# EAGLE design PlantWateringSolution (EAGLE 7.5.0)
Assembly variants: <unnamed>
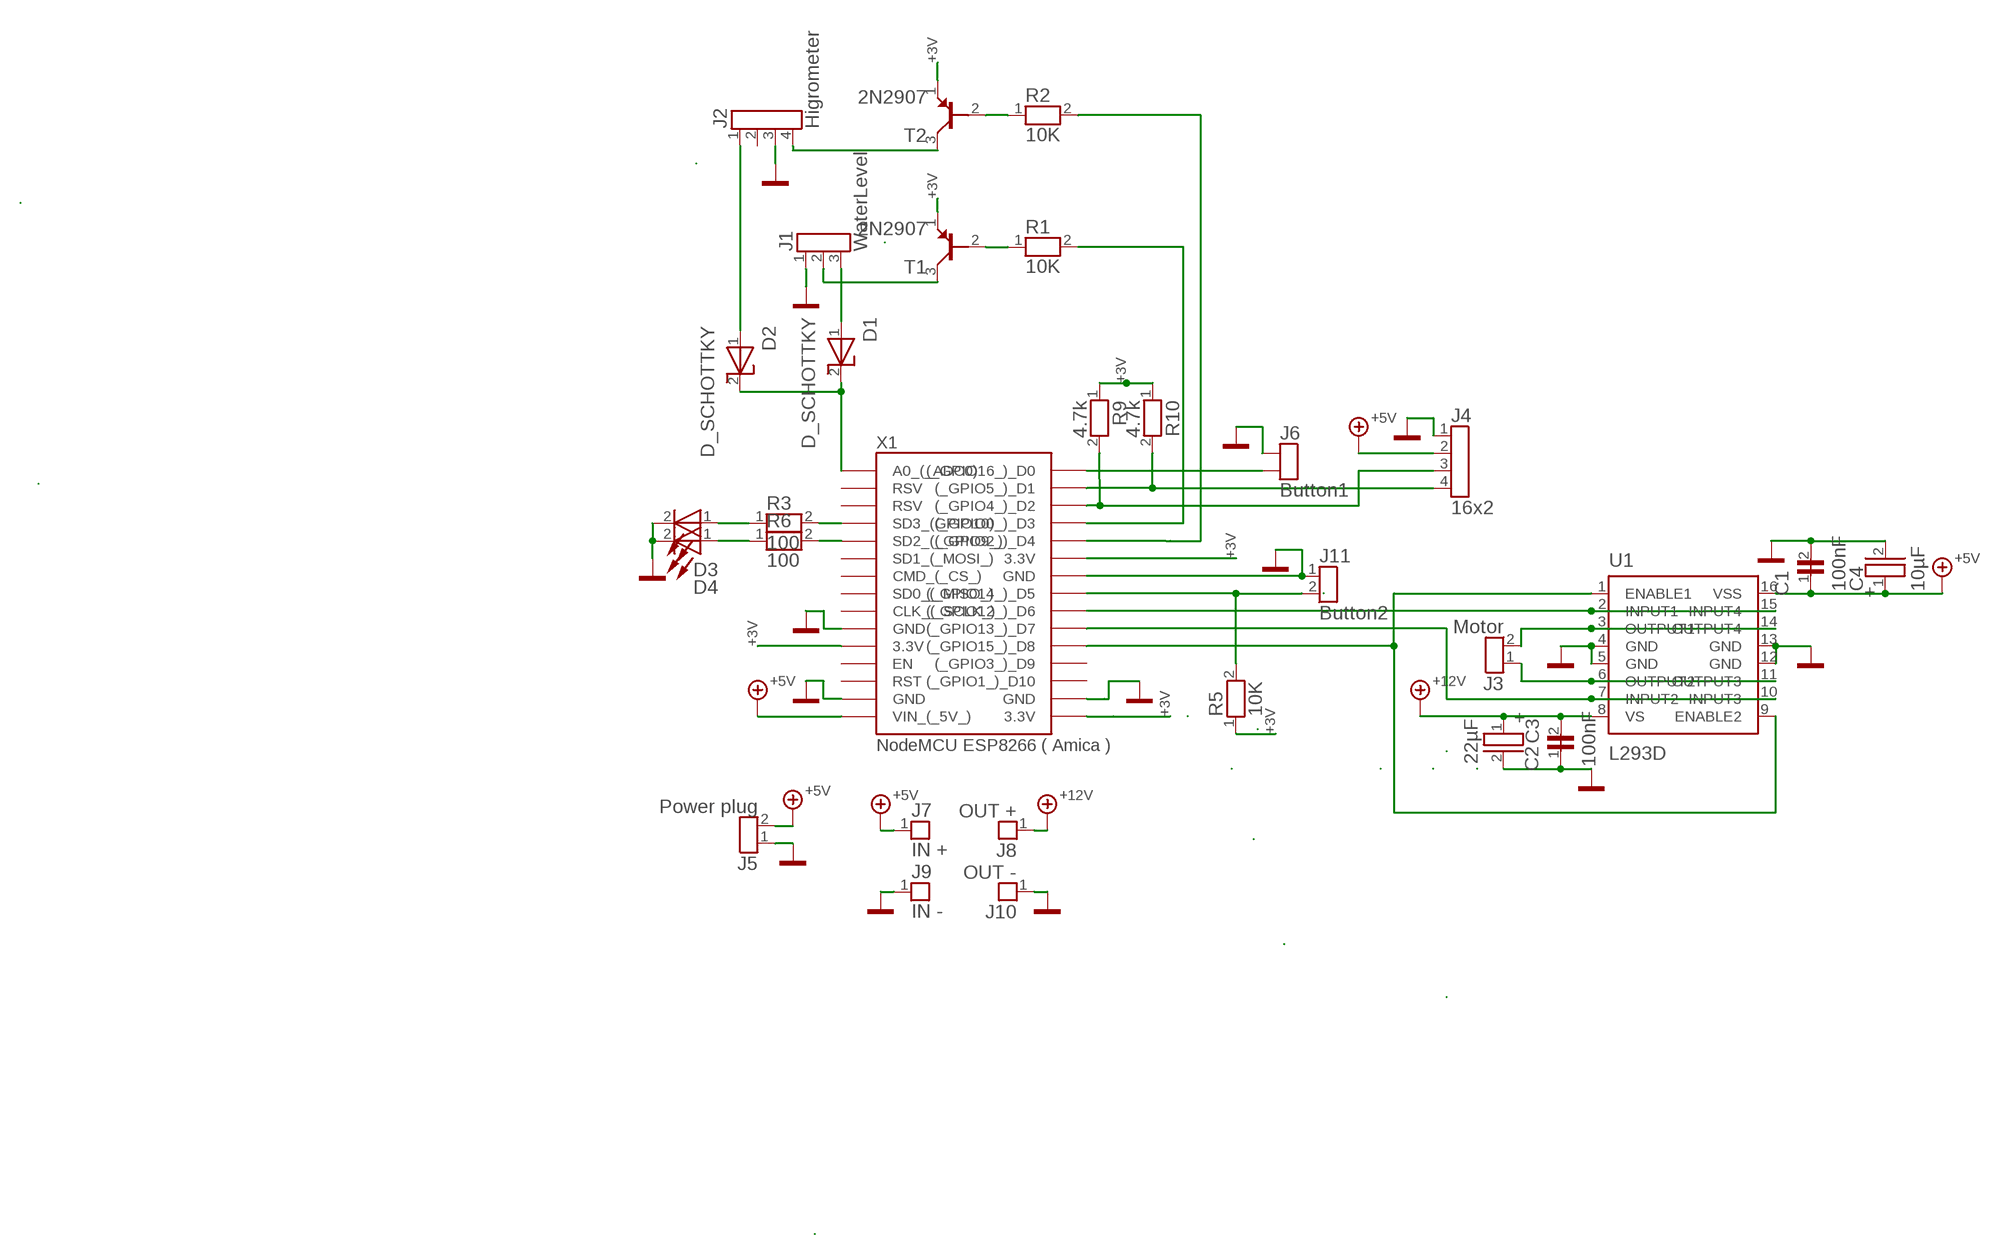
[diagram p0: schematic, sheet 1]

## Parts
C1  100nF  C-CERAMIC-2,54_100V_2%_100PF_18  [6X6R2,54_DISC_18]
C2  100nF  C-CERAMIC-2,54_100V_2%_100PF_19  [6X6R2,54_DISC_19]
C3  22µF  489D_10V_22µF_20  [D6R2,54_ELKO_20]
C4  10µF  489D_10V_22µF_21  [D6R2,54_ELKO_21]
D1  D_SCHOTTKY  D_SCHOTTKY_5  [DO35_5]
D2  D_SCHOTTKY  D_SCHOTTKY_6  [DO35_6]
D3  HLMA-KH00  HLMA-KH00_47  [LED_3MM_RED_47]
D4  HLMA-KH00  HLMA-KH00_42  [LED_3MM_RED_42]
D5  HLMA-KH00  HLMA-KH00_49  [LED_3MM_RED_49]  (not placed on a sheet)
J1  WaterLevel  PINHEADER_1X03_G_2,54_2  [STIFTLEISTE_1X03_G_2,54_2]
J2  Higrometer  PINHEADER_1X04_G_2,54_3  [STIFTLEISTE_1X04_G_2,54_3]
J3  Motor  PINHEADER_1X02_G_2,54_4  [STIFTLEISTE_1X02_G_2,54_4]
J4  16x2  PINHEADER_1X04_G_2,54_43  [STIFTLEISTE_1X04_G_2,54_43]
J5  Power plug  PINHEADER_1X02_G_2,54_50  [STIFTLEISTE_1X02_G_2,54_50]
J6  Button1  PINHEADER_1X02_G_2,54_60  (no package)
J7  IN +  PINHEADER_1X01_G_2,54_32  [STIFTLEISTE_1X01_G_2,54_32]
J8  OUT +  PINHEADER_1X01_G_2,54_33  [STIFTLEISTE_1X01_G_2,54_33]
J9  IN -  PINHEADER_1X01_G_2,54_34  [STIFTLEISTE_1X01_G_2,54_34]
J10  OUT -  PINHEADER_1X01_G_2,54_35  [STIFTLEISTE_1X01_G_2,54_35]
J11  Button2  PINHEADER_1X02_G_2,54_53  [STIFTLEISTE_1X02_G_2,54_53]
R1  10K  R-METAL_FILM_MF_0,4W_1%_510-KOHM_9  [0204_MET_9]
R2  10K  R-METAL_FILM_MF_0,4W_1%_510-KOHM_10  [0204_MET_10]
R3  100  R-METAL_FILM_MF_0,4W_1%_510-KOHM_46  [0204_MET_46]
R4  100  R-METAL_FILM_MF_0,4W_1%_510-KOHM_48  [0204_MET_48]  (not placed on a sheet)
R5  10K  R-METAL_FILM_MF_0,4W_1%_510-KOHM_31  [0204_MET_31]
R6  100  R-METAL_FILM_MF_0,4W_1%_510-KOHM_41  [0204_MET_41]
R9  4.7k  R-METAL_FILM_MF_0,4W_1%_510-KOHM_55  [0204_MET_55]
R10  4.7k  R-METAL_FILM_MF_0,4W_1%_510-KOHM_56  [0204_MET_56]
T1  2N2907  2N2907_7  [TO18_7]
T2  2N2907  2N2907_8  [TO18_8]
U1  L293D  L293D_1  [DIL16_1]
X1  NodeMCU ESP8266 ( Amica )  NODEMCU_ESP8266_(_AMICA_)_0  [NODEMCU_ESP8266_DEV_0]

## Nets
1: R2.1 T2.2(B)
(_GPIO16_)_D0: J6.2 X1.30((_GPIO16_)_D0)
+3V: R5.1 R9.1 R10.1 T1.1(E) T2.1(E) X1.11(3.3V) X1.16(3.3V) X1.25(3.3V)
+5V: C1.1 C4.1(+) J4.2 J5.2 J7.1 U1.16(VSS) X1.15(VIN_(_5V_))
+12V: C2.2 C3.1(+) J8.1 U1.8(VS)
A: D3.1(A) R3.1
B: R1.1 T1.2(B)
BUTTON3: J11.2 R5.2 X1.23((_GPIO14_)_D5)
ENABLE: U1.1(ENABLE1) U1.9(ENABLE2) X1.20((_GPIO15_)_D8)
GND: C1.2 C2.1 C3.2(-) C4.2(-) D3.2(K) D4.2(K) J1.1 J2.3 J4.1 J5.1 J6.1 J9.1 J10.1 J11.1 U1.4(GND) U1.5(GND) U1.12(GND) U1.13(GND) X1.10(GND) X1.14(GND) X1.17(GND) X1.24(GND)
HIGROMETER_SIG: D2.1(A) J2.1
HIGROMETER_VIN: J2.4 T2.3(C)
INPUT1: U1.2(INPUT1) U1.15(INPUT4) X1.22((_GPIO12_)_D6)
INPUT2: U1.7(INPUT2) U1.10(INPUT3) X1.21((_GPIO13_)_D7)
K: D1.2(K) D2.2(K) X1.1(A0_(_ADC0))
OUTPUT1: J3.2 U1.3(OUTPUT1) U1.14(OUTPUT4)
OUTPUT2: J3.1 U1.6(OUTPUT2) U1.11(OUTPUT3)
SCL: J4.4 R10.2 X1.29((_GPIO5_)_D1)
SD2_(_GPIO9_): R6.2 X1.5(SD2_(_GPIO9_))
SDA: J4.3 R9.2 X1.28((_GPIO4_)_D2)
SIG$127: D4.1(A) R6.1
SIG$131: R3.2 X1.4(SD3_(GPIO10))
SIG$151: J1.2 T1.3(C)
SIG$155: R2.2 X1.26((_GPIO2_)_D4)
WATERLEVEL_PNP: R1.2 X1.27((_GPIO0_)_D3)
WATERLEVEL_SIG: D1.1(A) J1.3
Unconnected: D5.1 D5.2 J2.2 R4.1 R4.2 X1.2(RSV) X1.3(RSV) X1.6(SD1_(_MOSI_)) X1.7(CMD_(_CS_)) X1.8(SD0_(_MISO_)) X1.9(CLK_(_SCLK_)) X1.12(EN) X1.13(RST) X1.18((_GPIO1_)_D10) X1.19((_GPIO3_)_D9)

## Library data of the parts
C1 = TARGET3001!_V20.2.0.74:C-CERAMIC-2,54_100V_2%_100PF_18: Typ EGPU ceramic generators for rectangles, 100 volt capacity. pF 100 ; material NPO ; tolerance ±2% ; dimension. mm 5 x
C2 = TARGET3001!_V20.2.0.74:C-CERAMIC-2,54_100V_2%_100PF_19: Typ EGPU ceramic generators for rectangles, 100 volt capacity. pF 100 ; material NPO ; tolerance ±2% ; dimension. mm 5 x
C3 = TARGET3001!_V20.2.0.74:489D_10V_22µF_20
C4 = TARGET3001!_V20.2.0.74:489D_10V_22µF_21
D1 = TARGET3001!_V20.2.0.74:D_SCHOTTKY_5
D2 = TARGET3001!_V20.2.0.74:D_SCHOTTKY_6
D3 = TARGET3001!_V20.2.0.74:HLMA-KH00_47
D4 = TARGET3001!_V20.2.0.74:HLMA-KH00_42
D5 = TARGET3001!_V20.2.0.74:HLMA-KH00_49
J1 = TARGET3001!_V20.2.0.74:PINHEADER_1X03_G_2,54_2: Pin Header
J2 = TARGET3001!_V20.2.0.74:PINHEADER_1X04_G_2,54_3: Pin Header
J3 = TARGET3001!_V20.2.0.74:PINHEADER_1X02_G_2,54_4: Pin Header
J4 = TARGET3001!_V20.2.0.74:PINHEADER_1X04_G_2,54_43: Pin Header
J5 = TARGET3001!_V20.2.0.74:PINHEADER_1X02_G_2,54_50: Pin Header
J6 = TARGET3001!_V20.2.0.74:PINHEADER_1X02_G_2,54_60: Pin Header
J7 = TARGET3001!_V20.2.0.74:PINHEADER_1X01_G_2,54_32: Pin Header
J8 = TARGET3001!_V20.2.0.74:PINHEADER_1X01_G_2,54_33: Pin Header
J9 = TARGET3001!_V20.2.0.74:PINHEADER_1X01_G_2,54_34: Pin Header
J10 = TARGET3001!_V20.2.0.74:PINHEADER_1X01_G_2,54_35: Pin Header
J11 = TARGET3001!_V20.2.0.74:PINHEADER_1X02_G_2,54_53: Pin Header
R1 = TARGET3001!_V20.2.0.74:R-METAL_FILM_MF_0,4W_1%_510-KOHM_9
R2 = TARGET3001!_V20.2.0.74:R-METAL_FILM_MF_0,4W_1%_510-KOHM_10
R3 = TARGET3001!_V20.2.0.74:R-METAL_FILM_MF_0,4W_1%_510-KOHM_46
R4 = TARGET3001!_V20.2.0.74:R-METAL_FILM_MF_0,4W_1%_510-KOHM_48
R5 = TARGET3001!_V20.2.0.74:R-METAL_FILM_MF_0,4W_1%_510-KOHM_31
R6 = TARGET3001!_V20.2.0.74:R-METAL_FILM_MF_0,4W_1%_510-KOHM_41
R9 = TARGET3001!_V20.2.0.74:R-METAL_FILM_MF_0,4W_1%_510-KOHM_55
R10 = TARGET3001!_V20.2.0.74:R-METAL_FILM_MF_0,4W_1%_510-KOHM_56
T1 = TARGET3001!_V20.2.0.74:2N2907_7: Bipolar-standard-power transistors component name 2 N 2907 ; Typ PNP ; VCEO (V) 40 ; IC (A) 0,6 max
T2 = TARGET3001!_V20.2.0.74:2N2907_8: Bipolar-standard-power transistors component name 2 N 2907 ; Typ PNP ; VCEO (V) 40 ; IC (A) 0,6 max
U1 = TARGET3001!_V20.2.0.74:L293D_1: 4-channel driver with diodes
X1 = TARGET3001!_V20.2.0.74:NODEMCU_ESP8266_(_AMICA_)_0: NodeMCU ESP8266 ( Amica )

## Board
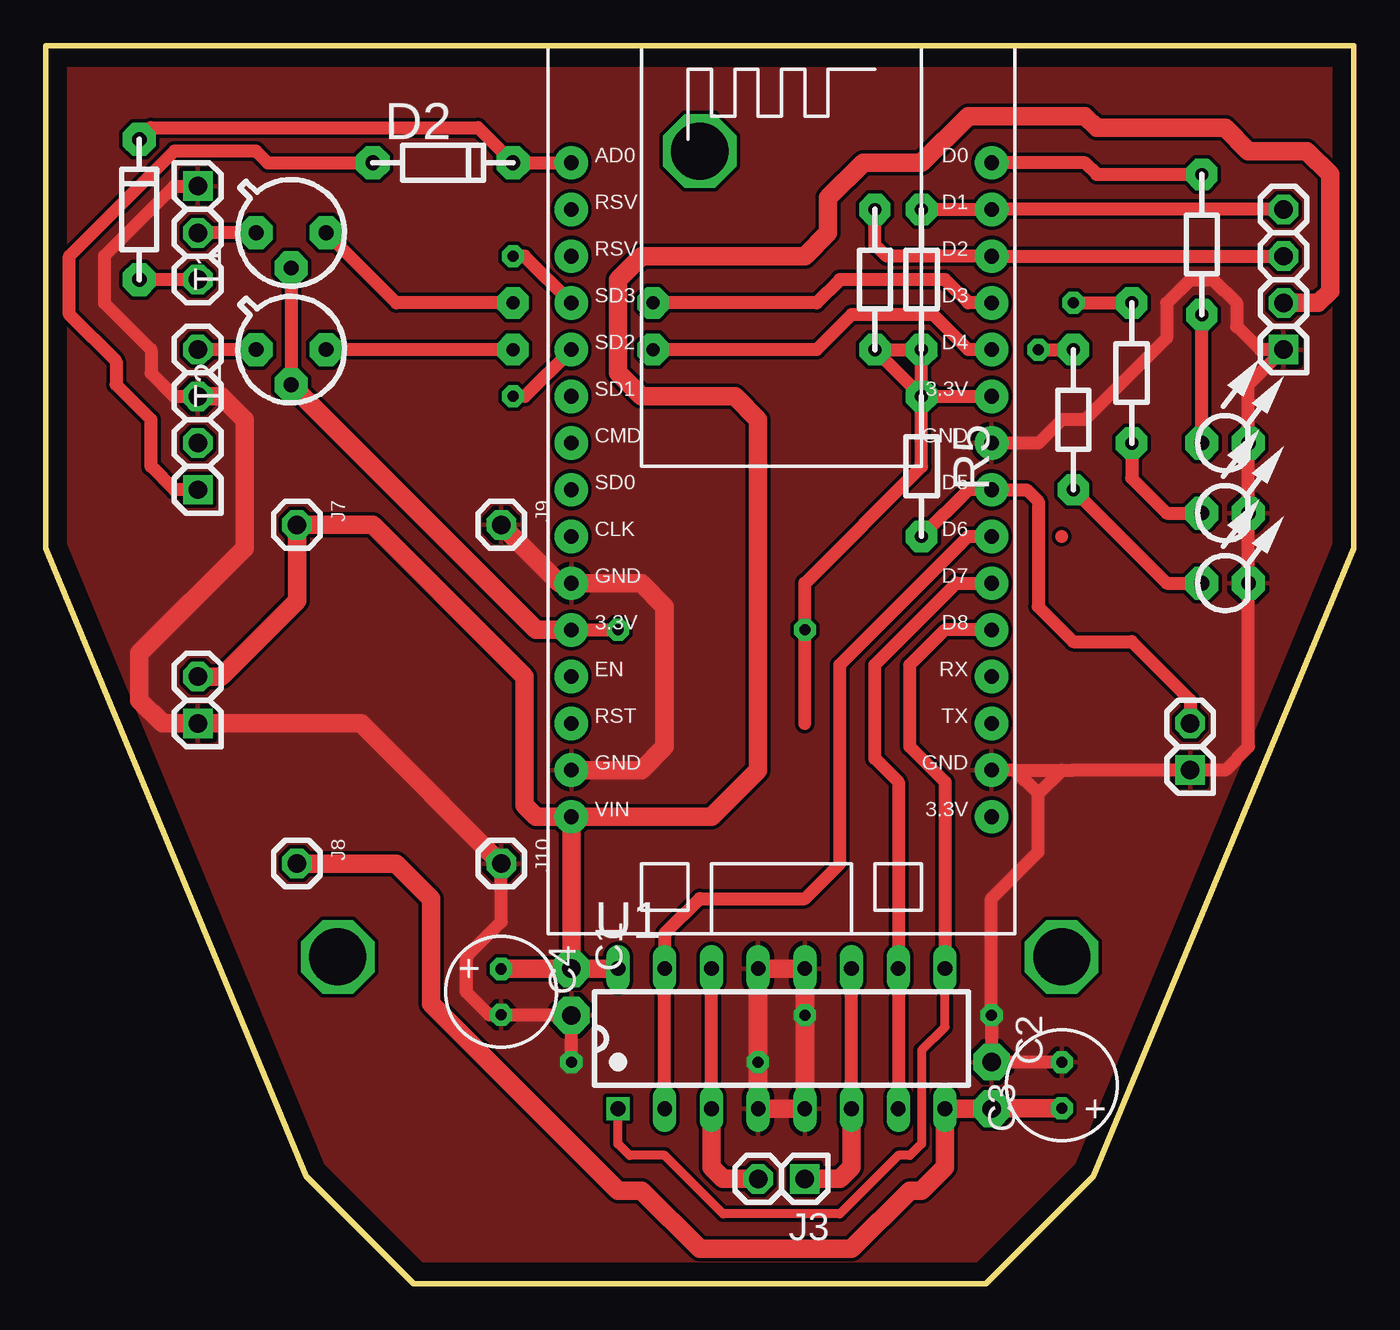
[diagram p1: board, top side]
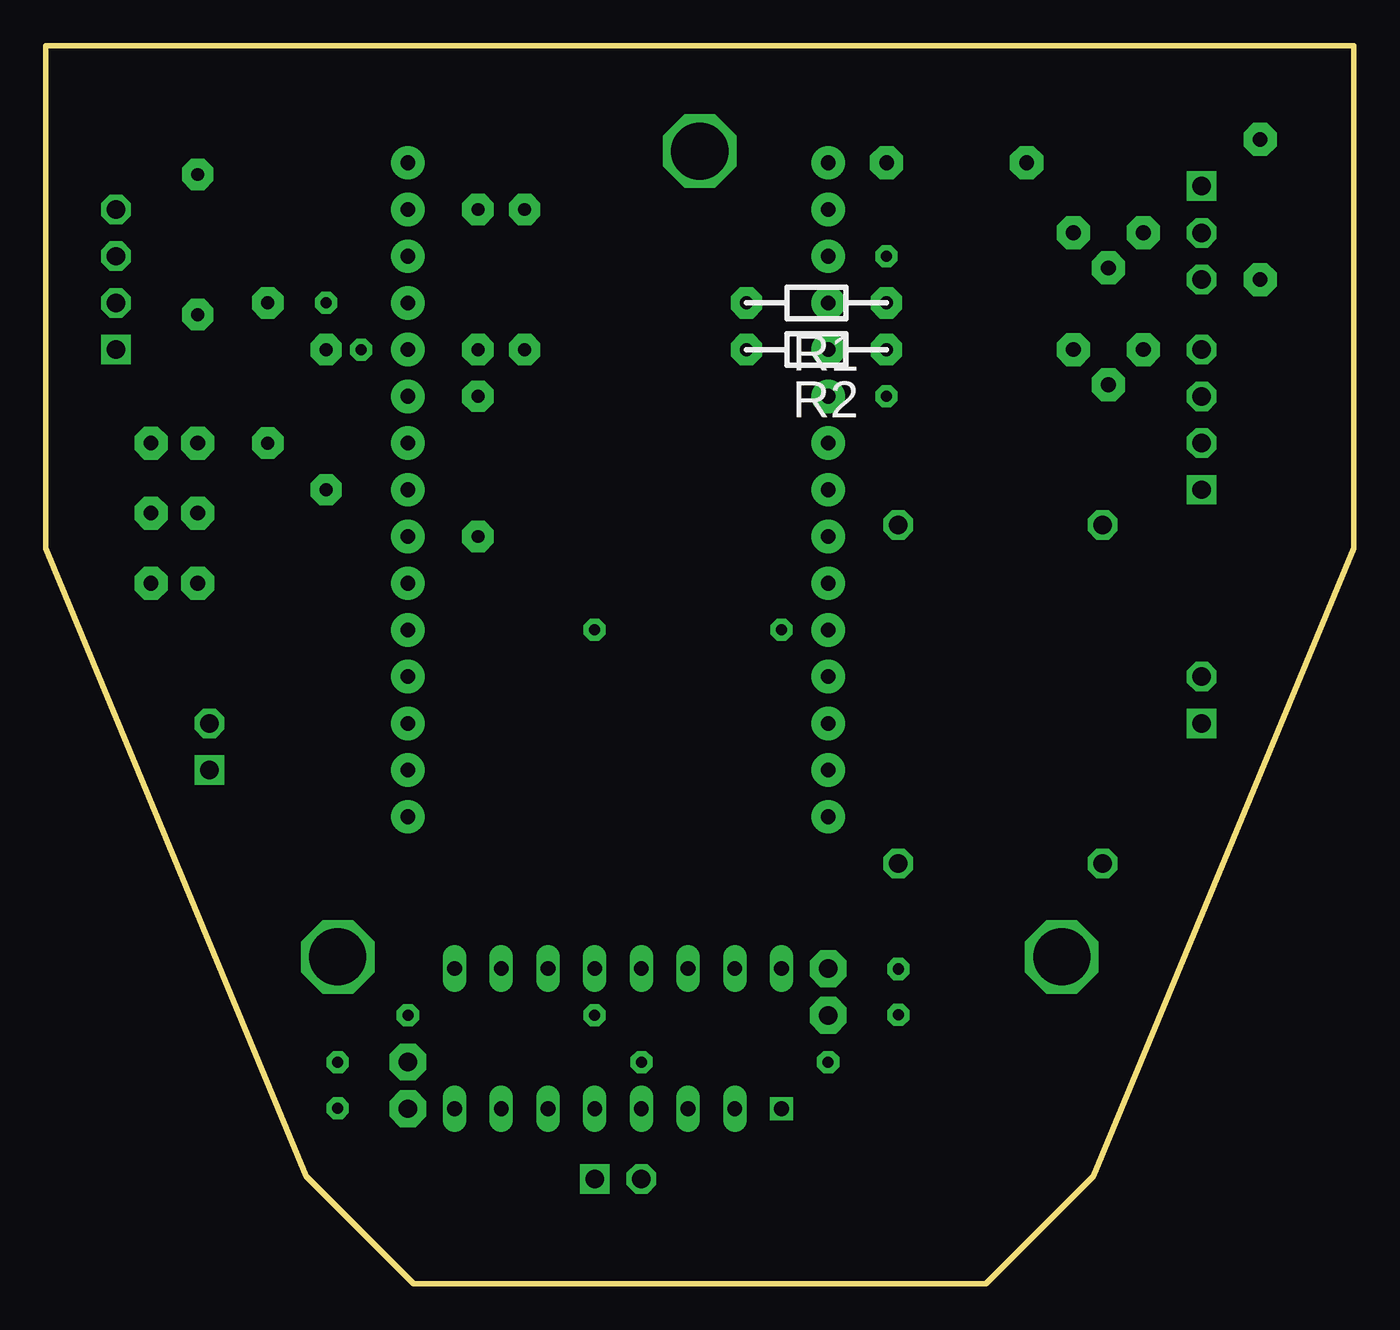
[diagram p2: board, bottom side, seen from below]

Size 71.12 x 67.31 mm. Coordinates in mm from the lower left corner, seen from the top.
Outline: 0,67.31 0,40 14.14,5.86 20,0 51.12,0 56.98,5.86 71.12,40 71.12,67.31 0,67.31
Copper layers (1*16): Top 0.035mm / dielectric 1.5mm / Bottom 0.035mm
Design rules "TARGET3001!": minimum track width 0.3mm, minimum drill 0.6mm, track to track 0.2mm, track to pad 0.2mm, pad to pad 0.2mm, via to via 0.2mm, smd to smd 0.2mm, copper to edge 1mm, drill to drill 0.3mm, minimum pad ring 0.235mm, minimum via ring 0.3mm, stop-mask expansion 4mil, vias tented up to drill 0mil, thermal gap 10mil

### Footprints (pad centres in the part's own frame; a part is rotated, then mirrored left to right if it is on the bottom)
6X6R2,54_DISC_18 = drill 1 pad 2 octagon: 1 -1.27,0; 2 1.27,0
6X6R2,54_DISC_19 = drill 1 pad 2 octagon: 1 -1.27,0; 2 1.27,0
D6R2,54_ELKO_20 = drill 0.6 pad 1.2 octagon: 1 -1.25,0; 2 1.25,0
D6R2,54_ELKO_21 = drill 0.6 pad 1.2 octagon: 1 -1.25,0; 2 1.25,0
DO35_5 = drill 0.8 pad 1.8 octagon: 1 -3.81,0; 2 3.81,0
DO35_6 = drill 0.8 pad 1.8 octagon: 1 -3.81,0; 2 3.81,0
LED_3MM_RED_47 = drill 0.8 pad 1.8 octagon: 1 -1.27,0; 2 1.27,0
LED_3MM_RED_42 = drill 0.8 pad 1.8 octagon: 1 -1.27,0; 2 1.27,0
LED_3MM_RED_49 = drill 0.8 pad 1.8 octagon: 1 -1.27,0; 2 1.27,0
STIFTLEISTE_1X03_G_2,54_2 = drill 1 pad 1.6 square: 1 0,0 | drill 1 pad 1.6 octagon: 2 2.54,0; 3 5.08,0
STIFTLEISTE_1X04_G_2,54_3 = drill 1 pad 1.6 square: 1 0,0 | drill 1 pad 1.6 octagon: 2 2.54,0; 3 5.08,0; 4 7.62,0
STIFTLEISTE_1X02_G_2,54_4 = drill 1 pad 1.6 square: 1 0,0 | drill 1 pad 1.6 octagon: 2 2.54,0
STIFTLEISTE_1X04_G_2,54_43 = drill 1 pad 1.6 square: 1 0,0 | drill 1 pad 1.6 octagon: 2 2.54,0; 3 5.08,0; 4 7.62,0
STIFTLEISTE_1X02_G_2,54_50 = drill 1 pad 1.6 square: 1 0,0 | drill 1 pad 1.6 octagon: 2 2.54,0
STIFTLEISTE_1X01_G_2,54_32 = drill 1 pad 1.6 octagon: 1 0,0
STIFTLEISTE_1X01_G_2,54_33 = drill 1 pad 1.6 octagon: 1 0,0
STIFTLEISTE_1X01_G_2,54_34 = drill 1 pad 1.6 octagon: 1 0,0
STIFTLEISTE_1X01_G_2,54_35 = drill 1 pad 1.6 octagon: 1 0,0
STIFTLEISTE_1X02_G_2,54_53 = drill 1 pad 1.6 square: 1 0,0 | drill 1 pad 1.6 octagon: 2 2.54,0
0204_MET_9 = drill 0.7 pad 1.7 octagon: 1 -3.81,0; 2 3.81,0
0204_MET_10 = drill 0.7 pad 1.7 octagon: 1 -3.81,0; 2 3.81,0
0204_MET_46 = drill 0.7 pad 1.7 octagon: 1 -3.81,0; 2 3.81,0
0204_MET_48 = drill 0.7 pad 1.7 octagon: 1 -3.81,0; 2 3.81,0
0204_MET_31 = drill 0.7 pad 1.7 octagon: 1 -3.81,0; 2 3.81,0
0204_MET_41 = drill 0.7 pad 1.7 octagon: 1 -3.81,0; 2 3.81,0
0204_MET_55 = drill 0.7 pad 1.7 octagon: 1 -3.81,0; 2 3.81,0
0204_MET_56 = drill 0.7 pad 1.7 octagon: 1 -3.81,0; 2 3.81,0
TO18_7 = drill 0.8 pad 1.8 octagon: 1 -1.905,0; 2 0,-1.905; 3 0,1.905
TO18_8 = drill 0.8 pad 1.8 octagon: 1 -1.905,0; 2 0,-1.905; 3 0,1.905
DIL16_1 = drill 0.8 pad 1.27 square: 1 -8.89,-3.81 | drill 0.8 pad 1.27 long: 2 -6.35,-3.81; 3 -3.81,-3.81; 4 -1.27,-3.81; 5 1.27,-3.81; 6 3.81,-3.81; 7 6.35,-3.81; 8 8.89,-3.81; 9 8.89,3.81; 10 6.35,3.81; 11 3.81,3.81; 12 1.27,3.81; 13 -1.27,3.81; 14 -3.81,3.81; 15 -6.35,3.81; 16 -8.89,3.81
NODEMCU_ESP8266_DEV_0 = drill 0.8 pad 1.816 round: 1 -11.43,17.78; 2 -11.43,15.24; 3 -11.43,12.7; 4 -11.43,10.16; 5 -11.43,7.62; 6 -11.43,5.08; 7 -11.43,2.54; 8 -11.43,0; 9 -11.43,-2.54; 10 -11.43,-5.08; 11 -11.43,-7.62; 12 -11.43,-10.16; 13 -11.43,-12.7; 14 -11.43,-15.24; 15 -11.43,-17.78; 16 11.43,-17.78; 17 11.43,-15.24; 18 11.43,-12.7; 19 11.43,-10.16; 20 11.43,-7.62; 21 11.43,-5.08; 22 11.43,-2.54; 23 11.43,0; 24 11.43,2.54; 25 11.43,5.08; 26 11.43,7.62; 27 11.43,10.16; 28 11.43,12.7; 29 11.43,15.24; 30 11.43,17.78

### Placement (x,y rotation side)
C1  28.58,15.88 270 top
C2  51.44,10.8 270 top
C3  55.25,10.8 90 top
C4  24.77,15.88 270 top
D1  5.08,58.42 90 top
D2  21.59,60.96 0 top
D3  64.14,41.91 0 top
D4  64.14,38.1 0 top
D5  64.14,45.72 0 top
J1  8.26,59.69 270 top
J2  8.26,43.18 90 top
J3  41.28,5.71 180 top
J4  67.31,50.8 90 top
J5  8.26,30.48 90 top
J7  13.65,41.27 270 top
J8  13.65,22.86 270 top
J9  24.77,41.27 270 top
J10  24.77,22.86 270 top
J11  62.23,27.94 90 top
R1  29.21,53.34 180 bottom
R2  29.21,50.8 180 bottom
R3  59.06,49.53 90 top
R4  62.87,56.52 90 top
R5  47.62,44.45 270 top
R6  55.88,46.99 90 top
R9  45.09,54.61 90 top
R10  47.62,54.61 90 top
T1  13.34,57.15 90 top
T2  13.34,50.8 90 top
U1  40.01,13.34 0 top
X1  40.01,43.18 0 top

### Tracks (layer width: path | path; a pad name or v marks a point on that pad's centre or on a via)
1
  Top 0.7: R2.1 T2.2
(_GPIO16_)_D0
  Top 0.7: X1.30 56.52,60.96 57.15,60.33 62.87,60.33
+3V  (via drill 0.6 pad 1.2)
  Top 0.7: T1.1 T2.1 | 41.28,30.48 v41.28,35.56 41.28,38.1 47.62,44.45 R5.1 | R5.1 X1.25 | R5.1 R10.1 R9.1 R5.1 | X1.11 v31.12,35.56
  Top 1: T2.1 26.67,35.56 X1.11
  other vias: 51.44,25.4 51.44,48.26
+5V
  Top 1: U1.16 C1.1 | C4.1 28.56,17.12 C1.1 | X1.15 26.67,25.4 26.04,26.04 26.04,33.02 17.78,41.27 J7.1 13.65,37.15 9.53,33.02 J5.2 | X1.15 C1.1 | J4.2 69.22,53.34 69.85,53.98 69.85,60.33 68.58,61.59 65.41,61.59 64.14,62.86 57.15,62.86 56.52,63.5 50.17,63.5 47.62,60.96 44.45,60.96 42.55,59.05 42.55,57.15 41.28,55.88 32.39,55.88 31.12,54.61 31.12,49.53 32.39,48.26 37.47,48.26 38.73,46.99 38.73,27.94 36.2,25.4 X1.15
+12V
  Top 0.3: 51.45,9.55 C2.2
  Top 1: C3.1 51.45,9.55 | C2.2 U1.8 48.9,6.35 47.62,5.08 46.99,5.08 43.82,1.91 35.56,1.91 32.39,5.08 31.12,5.08 20.96,15.24 20.96,20.95 19.05,22.86 J8.1
A
  Top 0.7: R3.1 59.06,43.81 60.96,41.91 D3.1
B
  Top 0.7: R1.1 19.05,53.34 T1.2
BUTTON3
  Top 0.7: J11.2 62.23,31.75 59.06,34.92 55.88,34.92 53.98,36.83 53.98,42.55 53.34,43.18 X1.23 50.17,43.18 R5.2 | 55.25,40.64
ENABLE
  Top 0.5: U1.9 48.9,13.97 47.62,12.7 47.62,7.62 46.99,6.98 46.36,6.98 43.18,3.81 36.83,3.81 33.66,6.98 31.75,6.98 31.12,7.62 U1.1
  Top 0.7: X1.20 48.9,35.56 46.99,33.66 46.99,29.21 48.9,27.3 U1.9
GND  (via drill 0.6 pad 1.2)
  Top 0.3: 28.56,14.62 C1.2 | 55.88,27.94 55.25,27.94
  Top 0.7: v28.58,12.07 C1.2 | C3.2 C2.1 v51.44,14.61 51.44,20.95 53.98,23.5 53.98,26.67 | 53.98,26.67 52.7,27.94 | 52.7,27.94 X1.17 | X1.24 53.98,45.72 55.25,46.99 56.52,46.99 60.96,51.44 60.96,53.34 62.23,54.61 63.5,54.61 64.77,53.34 64.77,52.07 66.04,50.8 J4.1 65.41,48.89 65.41,29.21 64.14,27.94 55.88,27.94 52.7,27.94 | 27.94,38.1 X1.10 | J1.1 6.98,59.69 3.18,55.88 3.18,53.34 5.72,50.8 5.72,49.53 6.98,48.26 J2.3 | J10.1 24.77,19.68 22.86,17.78 22.86,15.88 24.11,14.62 C4.2 28.56,14.62 | 55.25,27.94 53.98,26.67 | J9.1
  Top 1: U1.4 U1.5 | U1.4 v38.73,12.07 | U1.5 41.28,12.07 | U1.5 41.28,12.07 | 41.28,12.07 v41.28,14.61 U1.12 U1.13 v38.73,12.07 | U1.4 v38.73,12.07 | 27.94,38.1 J9.1 | J2.3 9.53,48.26 10.8,46.99 10.8,40.01 5.08,34.29 5.08,31.75 6.35,30.48 J5.1 17.15,30.48 J10.1 | X1.14 32.39,27.94 33.66,29.21 33.66,36.83 32.39,38.1 X1.10 | 20.32,27.3
  pour Top: 71.12,0 71.12,67.31 0,67.31 0,0
HIGROMETER_PNP
  Top 0.7: 51.44,50.8 50.17,50.8 48.26,52.7 43.82,52.7 41.91,50.8 33.02,50.8
HIGROMETER_SIG
  Top 0.7: J2.1 6.98,43.18 5.72,44.45 5.72,46.99 3.81,48.89 3.81,50.16 1.27,52.7 1.27,55.88 6.98,61.59 11.43,61.59 12.07,60.96 D2.1
HIGROMETER_VIN
  Top 0.7: T2.3 J2.4
INPUT1
  Top 0.7: U1.2 U1.15 33.66,19.05 35.56,20.95 41.28,20.95 43.18,22.86 43.18,33.66 50.17,40.64 X1.22
INPUT2
  Top 0.7: U1.7 U1.10 46.36,27.3 45.09,28.57 45.09,33.66 49.53,38.1 X1.21
K
  Top 0.7: X1.1 D2.2 23.5,62.86 5.72,62.86 D1.2 | D1.2
OUTPUT1
  Top 0.7: U1.3 U1.14
  Top 1: J3.2 36.83,5.71 36.2,6.35 U1.3
OUTPUT2
  Top 0.7: U1.6 U1.11
  Top 1: J3.1 43.18,5.71 43.82,6.35 U1.6
SCL
  Top 0.7: J4.4 X1.29 R10.2
SD2_(_GPIO9_)  (via drill 0.6 pad 1.2)
  Top 0.7: X1.5 26.04,48.26 v25.4,48.26 | v53.98,50.8 R6.2
SDA
  Top 0.7: J4.3 X1.28 45.72,55.88 45.09,56.52 R9.2
SIG$125
  Top 0.7: 62.87,45.72 62.87,52.7
SIG$127
  Top 0.7: R6.1 60.96,38.1 D4.1
SIG$131  (via drill 0.6 pad 1.2)
  Top 0.7: X1.4 26.04,55.88 v25.4,55.88 | v55.88,53.34 R3.2
WATERLEVEL_PNP
  Top 0.7: X1.27 50.17,53.34 48.9,54.61 43.18,54.61 41.91,53.34 R1.2
WATERLEVEL_SIG
  Top 0.7: J1.3 D1.1
WATERLEVEL_VIN
  Top 0.7: 11.43,57.15 8.26,57.15
WITHOUT_SIGNAL  (via drill 3.1 pad 4)
  other vias: 35.56,61.59 15.88,17.78 55.25,17.78